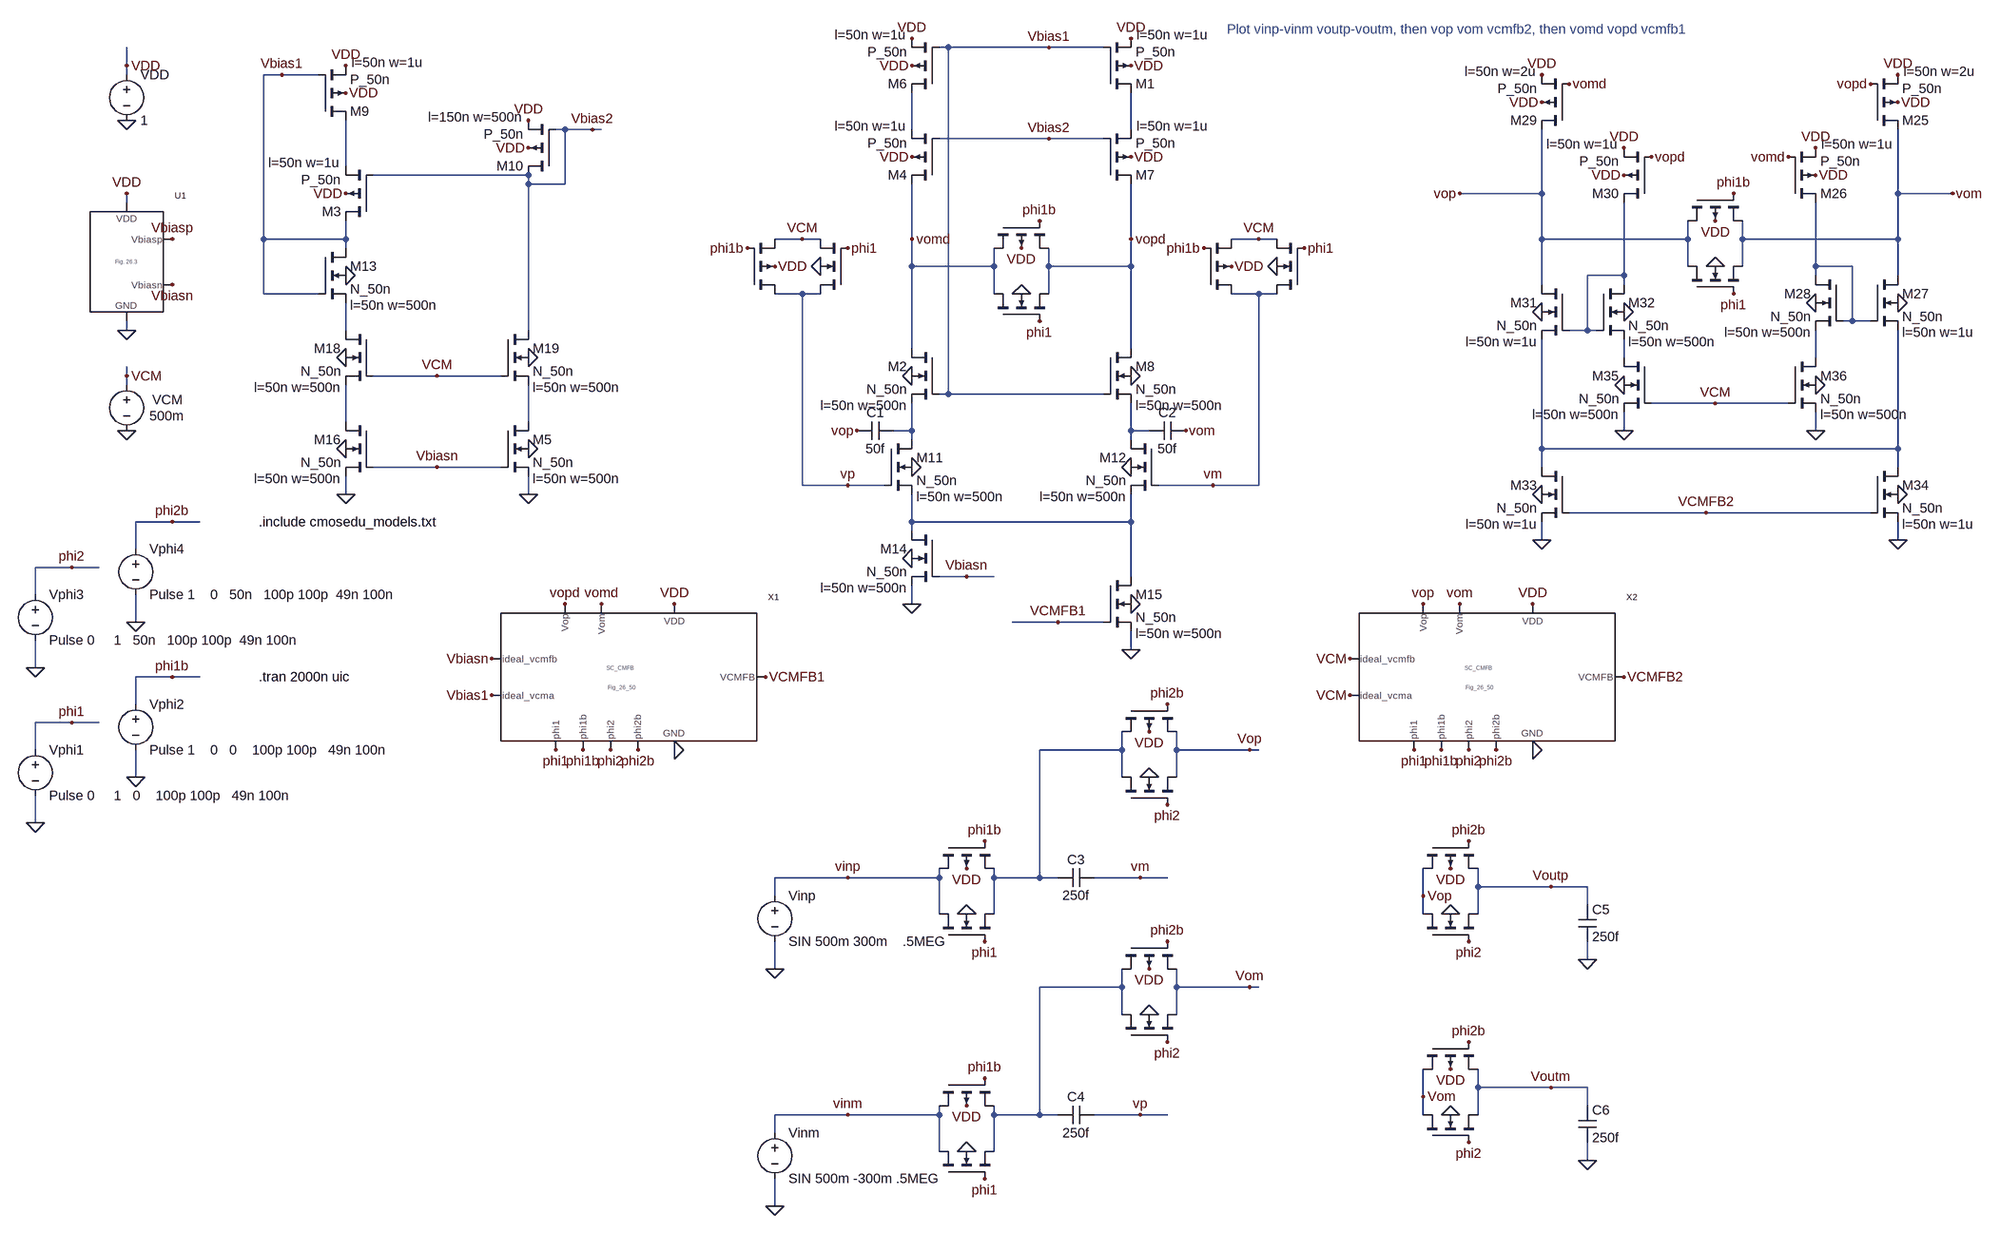
[diagram p0: schematic Fig26_59.asc]
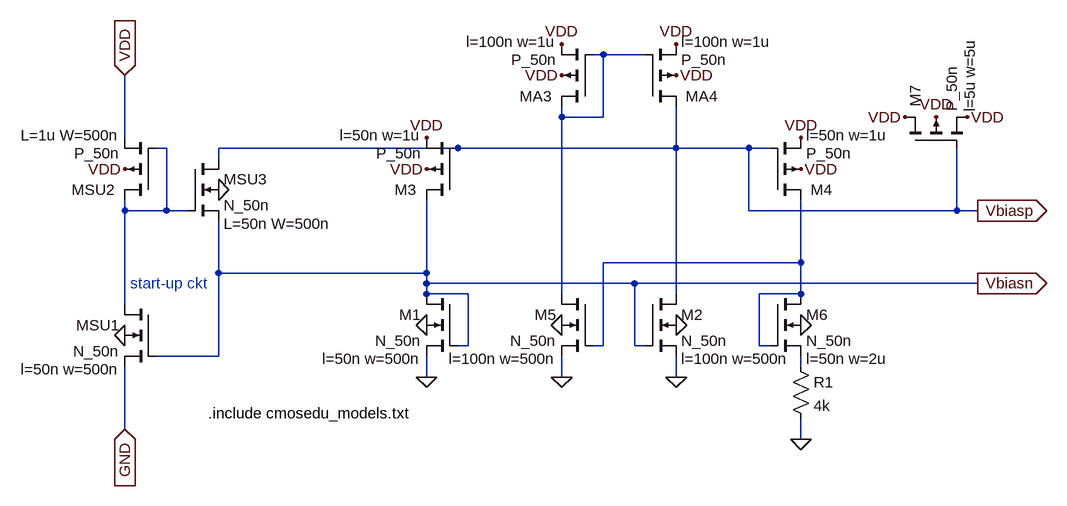
[diagram p1: sub-circuit fig_26_3.asc]
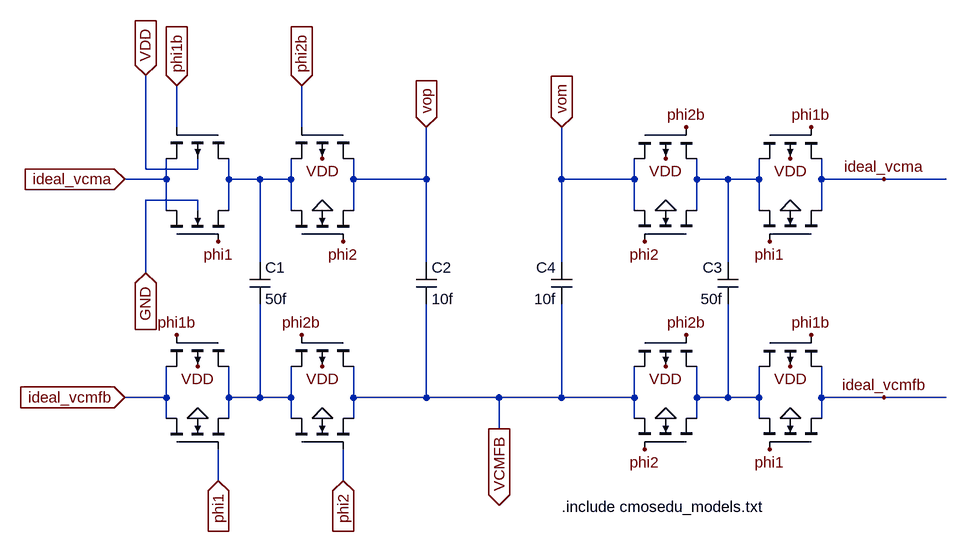
[diagram p2: sub-circuit fig_26_50.asc]
Fig26_59.asc, the LTspice schematic file:
Version 4
SHEET 1 4072 1492
WIRE 2240 -592 2224 -592
WIRE 2416 -592 2240 -592
WIRE 2512 -592 2416 -592
WIRE 800 -560 800 -592
WIRE 800 -544 800 -560
WIRE 1072 -544 1040 -544
WIRE 1136 -544 1072 -544
WIRE 1568 -448 1552 -448
WIRE 1616 -448 1568 -448
WIRE 1632 -448 1616 -448
WIRE 2176 -448 2176 -512
WIRE 2560 -448 2560 -512
WIRE 2416 -432 2224 -432
WIRE 2512 -432 2416 -432
WIRE 1184 -384 1184 -464
WIRE 1504 -368 1232 -368
WIRE 1504 -352 1504 -368
WIRE 1568 -352 1568 -448
WIRE 1568 -352 1504 -352
WIRE 3280 -336 3280 -448
WIRE 3280 -336 3136 -336
WIRE 3904 -336 3904 -448
WIRE 4000 -336 3904 -336
WIRE 800 -320 800 -336
WIRE 1040 -256 1040 -544
WIRE 1184 -256 1184 -288
WIRE 1184 -256 1040 -256
WIRE 1984 -256 1936 -256
WIRE 2016 -256 1984 -256
WIRE 2176 -256 2176 -352
WIRE 2560 -256 2560 -352
WIRE 2784 -256 2736 -256
WIRE 2816 -256 2784 -256
WIRE 3280 -256 3280 -336
WIRE 3536 -256 3536 -288
WIRE 3536 -256 3280 -256
WIRE 3632 -256 3632 -288
WIRE 3904 -256 3904 -336
WIRE 3904 -256 3632 -256
WIRE 1184 -240 1184 -256
WIRE 2176 -208 2176 -256
WIRE 2320 -208 2320 -240
WIRE 2320 -208 2176 -208
WIRE 2416 -208 2416 -240
WIRE 2560 -208 2560 -256
WIRE 2560 -208 2416 -208
WIRE 3536 -208 3536 -256
WIRE 3632 -208 3632 -256
WIRE 3760 -208 3760 -320
WIRE 3824 -208 3760 -208
WIRE 3424 -192 3424 -320
WIRE 3424 -192 3360 -192
WIRE 3760 -192 3760 -208
WIRE 3904 -192 3904 -256
WIRE 3280 -176 3280 -256
WIRE 3424 -176 3424 -192
WIRE 1040 -160 1040 -256
WIRE 1136 -160 1040 -160
WIRE 1984 -160 1936 -160
WIRE 2016 -160 1984 -160
WIRE 2320 -160 2320 -208
WIRE 2416 -160 2416 -208
WIRE 2784 -160 2736 -160
WIRE 2816 -160 2784 -160
WIRE 3824 -112 3824 -208
WIRE 3824 -112 3808 -112
WIRE 3856 -112 3824 -112
WIRE 800 -96 800 -112
WIRE 1184 -96 1184 -144
WIRE 1504 -96 1504 -352
WIRE 3360 -96 3360 -192
WIRE 3360 -96 3328 -96
WIRE 3376 -96 3360 -96
WIRE 2176 -64 2176 -208
WIRE 2560 -64 2560 -208
WIRE 3424 -48 3424 -80
WIRE 3760 -48 3760 -96
WIRE 800 -16 800 -32
WIRE 1344 -16 1232 -16
WIRE 1456 -16 1344 -16
WIRE 800 0 800 -16
WIRE 2240 16 2240 -592
WIRE 2240 16 2224 16
WIRE 2512 16 2240 16
WIRE 3584 32 3472 32
WIRE 3712 32 3584 32
WIRE 1184 64 1184 0
WIRE 1504 64 1504 0
WIRE 2176 80 2176 32
WIRE 2176 80 2144 80
WIRE 2560 80 2560 32
WIRE 2592 80 2560 80
WIRE 3424 80 3424 48
WIRE 3760 80 3760 48
WIRE 2176 96 2176 80
WIRE 2560 96 2560 80
WIRE 3280 112 3280 -80
WIRE 3904 112 3904 -96
WIRE 3904 112 3280 112
WIRE 1344 144 1232 144
WIRE 1456 144 1344 144
WIRE 3280 144 3280 112
WIRE 3904 144 3904 112
WIRE 1984 176 1984 -160
WIRE 2064 176 1984 176
WIRE 2128 176 2064 176
WIRE 2704 176 2608 176
WIRE 2784 176 2784 -160
WIRE 2784 176 2704 176
WIRE 1184 192 1184 160
WIRE 1504 192 1504 160
WIRE 3568 224 3328 224
WIRE 3856 224 3568 224
WIRE 880 240 816 240
WIRE 928 240 880 240
WIRE 2176 240 2176 192
WIRE 2560 240 2560 192
WIRE 2560 240 2176 240
WIRE 2176 256 2176 240
WIRE 3280 272 3280 240
WIRE 3904 272 3904 240
WIRE 816 288 816 240
WIRE 704 320 640 320
WIRE 752 320 704 320
WIRE 2272 336 2224 336
WIRE 2320 336 2272 336
WIRE 2560 336 2560 240
WIRE 640 368 640 320
WIRE 2176 384 2176 352
WIRE 816 416 816 368
WIRE 2432 416 2352 416
WIRE 2512 416 2432 416
WIRE 2560 464 2560 432
WIRE 640 496 640 448
WIRE 880 512 816 512
WIRE 928 512 880 512
WIRE 816 560 816 512
WIRE 704 592 640 592
WIRE 752 592 704 592
WIRE 640 640 640 592
WIRE 2544 640 2544 608
WIRE 2544 640 2400 640
WIRE 2640 640 2640 608
WIRE 2768 640 2640 640
WIRE 2784 640 2768 640
WIRE 816 688 816 640
WIRE 2544 688 2544 640
WIRE 2640 688 2640 640
WIRE 640 768 640 720
WIRE 2064 864 1936 864
WIRE 2224 864 2224 848
WIRE 2224 864 2064 864
WIRE 2320 864 2320 848
WIRE 2400 864 2400 640
WIRE 2400 864 2320 864
WIRE 2432 864 2400 864
WIRE 2576 864 2496 864
WIRE 2624 864 2576 864
WIRE 3168 880 3168 848
WIRE 3296 880 3168 880
WIRE 3360 880 3296 880
WIRE 1936 896 1936 864
WIRE 3072 896 3072 848
WIRE 3360 912 3360 880
WIRE 2224 928 2224 864
WIRE 2320 928 2320 864
WIRE 3072 928 3072 896
WIRE 3168 928 3168 880
WIRE 3360 1008 3360 976
WIRE 1936 1024 1936 976
WIRE 2544 1056 2544 1024
WIRE 2544 1056 2400 1056
WIRE 2640 1056 2640 1024
WIRE 2768 1056 2640 1056
WIRE 2784 1056 2768 1056
WIRE 2544 1104 2544 1056
WIRE 2640 1104 2640 1056
WIRE 3168 1232 3168 1200
WIRE 3296 1232 3168 1232
WIRE 3360 1232 3296 1232
WIRE 3072 1248 3072 1200
WIRE 3360 1264 3360 1232
WIRE 2064 1280 1936 1280
WIRE 2224 1280 2224 1264
WIRE 2224 1280 2064 1280
WIRE 2320 1280 2320 1264
WIRE 2400 1280 2400 1056
WIRE 2400 1280 2320 1280
WIRE 2432 1280 2400 1280
WIRE 2576 1280 2496 1280
WIRE 2624 1280 2576 1280
WIRE 3072 1280 3072 1248
WIRE 3168 1280 3168 1232
WIRE 1936 1312 1936 1280
WIRE 2224 1344 2224 1280
WIRE 2320 1344 2320 1280
WIRE 3360 1360 3360 1328
WIRE 1936 1440 1936 1392
FLAG 800 -464 0
FLAG 800 -560 VDD
FLAG 2176 -16 0
FLAG 1184 -336 VDD
FLAG 800 -336 VDD
FLAG 800 -96 0
FLAG 800 80 0
FLAG 880 -176 Vbiasn
FLAG 880 -256 Vbiasp
FLAG 800 -16 VCM
FLAG 2176 -560 VDD
FLAG 1184 -512 VDD
FLAG 1184 -560 VDD
FLAG 1504 -416 VDD
FLAG 1504 -464 VDD
FLAG 1184 -192 0
FLAG 1504 112 0
FLAG 1184 112 0
FLAG 1184 -48 0
FLAG 1504 -48 0
FLAG 1184 192 0
FLAG 1504 192 0
FLAG 1344 -16 VCM
FLAG 1344 144 Vbiasn
FLAG 1616 -448 Vbias2
FLAG 2560 -560 VDD
FLAG 2176 -608 VDD
FLAG 2560 -608 VDD
FLAG 2176 -400 VDD
FLAG 2560 -400 VDD
FLAG 2560 -16 0
FLAG 2176 144 0
FLAG 2560 144 0
FLAG 2176 304 0
FLAG 2560 384 0
FLAG 2176 384 0
FLAG 2560 464 0
FLAG 2272 336 Vbiasn
FLAG 2432 416 VCMFB1
FLAG 2416 -592 Vbias1
FLAG 2416 -432 Vbias2
FLAG 2368 -240 VDD
FLAG 2400 -288 phi1b
FLAG 2368 -160 0
FLAG 2400 -112 phi1
FLAG 1760 640 0
FLAG 1760 384 VDD
FLAG 1920 512 VCMFB1
FLAG 1552 640 phi1
FLAG 1600 640 phi1b
FLAG 1648 640 phi2
FLAG 1696 640 phi2b
FLAG 1440 480 Vbiasn
FLAG 1440 544 Vbias1
FLAG 1568 384 vopd
FLAG 1632 384 vomd
FLAG 2176 -256 vomd
FLAG 2560 -256 vopd
FLAG 2064 176 vp
FLAG 2704 176 vm
FLAG 1936 -208 VDD
FLAG 1888 -240 phi1b
FLAG 2016 -208 0
FLAG 2064 -240 phi1
FLAG 1984 -256 VCM
FLAG 2736 -208 VDD
FLAG 2688 -240 phi1b
FLAG 2816 -208 0
FLAG 2864 -240 phi1
FLAG 2784 -256 VCM
FLAG 1072 -544 Vbias1
FLAG 2080 80 vop
FLAG 2656 80 vom
FLAG 3904 -544 VDD
FLAG 3904 -496 VDD
FLAG 3760 -416 VDD
FLAG 3760 -368 VDD
FLAG 3904 -144 0
FLAG 3760 -144 0
FLAG 3856 -528 vopd
FLAG 3712 -400 vomd
FLAG 3280 -544 VDD
FLAG 3280 -496 VDD
FLAG 3424 -416 VDD
FLAG 3424 -368 VDD
FLAG 3280 -128 0
FLAG 3424 -128 0
FLAG 3328 -528 vomd
FLAG 3472 -400 vopd
FLAG 3280 192 0
FLAG 3904 192 0
FLAG 3568 224 VCMFB2
FLAG 3136 -336 vop
FLAG 4000 -336 vom
FLAG 3424 0 0
FLAG 3424 80 0
FLAG 3760 0 0
FLAG 3760 80 0
FLAG 3904 272 0
FLAG 3280 272 0
FLAG 3584 32 VCM
FLAG 3584 -288 VDD
FLAG 3616 -336 phi1b
FLAG 3584 -208 0
FLAG 3616 -160 phi1
FLAG 3264 640 0
FLAG 3264 384 VDD
FLAG 3424 512 VCMFB2
FLAG 3056 640 phi1
FLAG 3104 640 phi1b
FLAG 3152 640 phi2
FLAG 3200 640 phi2b
FLAG 2944 480 VCM
FLAG 2944 544 VCM
FLAG 3072 384 vop
FLAG 3136 384 vom
FLAG 2272 848 VDD
FLAG 2304 800 phi1b
FLAG 2272 928 0
FLAG 2304 976 phi1
FLAG 1936 1024 0
FLAG 2576 864 vm
FLAG 2592 608 VDD
FLAG 2624 560 phi2b
FLAG 2592 688 0
FLAG 2624 736 phi2
FLAG 2768 640 Vop
FLAG 2272 1264 VDD
FLAG 2304 1216 phi1b
FLAG 2272 1344 0
FLAG 2304 1392 phi1
FLAG 1936 1440 0
FLAG 2576 1280 vp
FLAG 2592 1024 VDD
FLAG 2624 976 phi2b
FLAG 2592 1104 0
FLAG 2624 1152 phi2
FLAG 2768 1056 Vom
FLAG 3120 848 VDD
FLAG 3152 800 phi2b
FLAG 3120 928 0
FLAG 3152 976 phi2
FLAG 3296 880 Voutp
FLAG 3120 1200 VDD
FLAG 3152 1152 phi2b
FLAG 3120 1280 0
FLAG 3152 1328 phi2
FLAG 3296 1232 Voutm
FLAG 3072 896 Vop
FLAG 3072 1248 Vom
FLAG 3360 1008 0
FLAG 3360 1360 0
FLAG 2064 864 vinp
FLAG 2064 1280 vinm
FLAG 640 768 0
FLAG 704 592 phi1
FLAG 816 688 0
FLAG 880 512 phi1b
FLAG 640 496 0
FLAG 704 320 phi2
FLAG 816 416 0
FLAG 880 240 phi2b
SYMBOL voltage 800 -560 R0
WINDOW 123 0 0 Left 2
WINDOW 39 0 0 Left 2
SYMATTR InstName VDD
SYMATTR Value 1
SYMBOL nmos4 2224 -64 M0
WINDOW 123 56 100 Left 2
SYMATTR Value2 l=50n w=500n
SYMATTR InstName M2
SYMATTR Value N_50n
SYMBOL pmos4 1232 -288 R180
WINDOW 123 58 102 Left 2
WINDOW 0 56 16 Left 2
SYMATTR Value2 l=50n w=1u
SYMATTR InstName M3
SYMATTR Value P_50n
SYMBOL voltage 800 -16 R0
WINDOW 0 45 42 Left 2
WINDOW 3 40 70 Left 2
WINDOW 123 0 0 Left 2
WINDOW 39 0 0 Left 2
SYMATTR InstName VCM
SYMATTR Value 500m
SYMBOL Fig_26_3 736 -208 R0
SYMATTR InstName U1
SYMBOL pmos4 2224 -512 R180
WINDOW 123 58 102 Left 2
WINDOW 0 56 16 Left 2
SYMATTR Value2 l=50n w=1u
SYMATTR InstName M6
SYMATTR Value P_50n
SYMBOL pmos4 1136 -464 M180
WINDOW 123 58 102 Left 2
WINDOW 0 56 16 Left 2
SYMATTR Value2 l=50n w=1u
SYMATTR InstName M9
SYMATTR Value P_50n
SYMBOL pmos4 1552 -368 R180
WINDOW 123 58 102 Left 2
WINDOW 0 56 16 Left 2
SYMATTR Value2 l=150n w=500n
SYMATTR InstName M10
SYMATTR Value P_50n
SYMBOL nmos4 1136 -240 R0
WINDOW 123 56 100 Left 2
SYMATTR Value2 l=50n w=500n
SYMATTR InstName M13
SYMATTR Value N_50n
SYMBOL nmos4 1456 64 R0
WINDOW 123 56 100 Left 2
SYMATTR Value2 l=50n w=500n
SYMATTR InstName M5
SYMATTR Value N_50n
SYMBOL nmos4 1232 64 M0
WINDOW 123 56 100 Left 2
SYMATTR Value2 l=50n w=500n
SYMATTR InstName M16
SYMATTR Value N_50n
SYMBOL nmos4 1232 -96 M0
WINDOW 123 56 100 Left 2
SYMATTR Value2 l=50n w=500n
SYMATTR InstName M18
SYMATTR Value N_50n
SYMBOL nmos4 1456 -96 R0
WINDOW 123 56 100 Left 2
SYMATTR Value2 l=50n w=500n
SYMATTR InstName M19
SYMATTR Value N_50n
SYMBOL pmos4 2512 -512 M180
WINDOW 123 58 102 Left 2
WINDOW 0 56 16 Left 2
SYMATTR Value2 l=50n w=1u
SYMATTR InstName M1
SYMATTR Value P_50n
SYMBOL pmos4 2224 -352 R180
WINDOW 123 58 102 Left 2
WINDOW 0 56 16 Left 2
SYMATTR Value2 l=50n w=1u
SYMATTR InstName M4
SYMATTR Value P_50n
SYMBOL pmos4 2512 -352 M180
WINDOW 123 58 102 Left 2
WINDOW 0 56 16 Left 2
SYMATTR Value2 l=50n w=1u
SYMATTR InstName M7
SYMATTR Value P_50n
SYMBOL nmos4 2512 -64 R0
WINDOW 123 56 100 Left 2
SYMATTR Value2 l=50n w=500n
SYMATTR InstName M8
SYMATTR Value N_50n
SYMBOL nmos4 2128 96 R0
WINDOW 123 56 100 Left 2
SYMATTR Value2 l=50n w=500n
SYMATTR InstName M11
SYMATTR Value N_50n
SYMBOL nmos4 2608 96 M0
WINDOW 123 56 100 Left 2
SYMATTR Value2 l=50n w=500n
SYMATTR InstName M12
SYMATTR Value N_50n
SYMBOL nmos4 2224 256 M0
WINDOW 123 56 100 Left 2
SYMATTR Value2 l=50n w=500n
SYMATTR InstName M14
SYMATTR Value N_50n
SYMBOL nmos4 2512 336 R0
WINDOW 123 56 100 Left 2
SYMATTR Value2 l=50n w=500n
SYMATTR InstName M15
SYMATTR Value N_50n
SYMBOL pmos4 2320 -288 M90
WINDOW 0 56 16 Invisible 2
WINDOW 3 56 72 Invisible 2
SYMATTR InstName M17
SYMATTR Value P_50n
SYMATTR Value2 l=50n w=500n
SYMBOL nmos4 2320 -112 R270
WINDOW 0 56 32 Invisible 2
WINDOW 3 56 72 Invisible 2
SYMATTR InstName M20
SYMATTR Value N_50n
SYMATTR Value2 l=50n w=500n
SYMBOL Fig_26_50 1488 592 R0
SYMATTR InstName X1
SYMBOL pmos4 1888 -160 M180
WINDOW 0 56 16 Invisible 2
WINDOW 3 56 72 Invisible 2
SYMATTR InstName M21
SYMATTR Value P_50n
SYMATTR Value2 l=50n w=500n
SYMBOL nmos4 2064 -160 R180
WINDOW 0 56 32 Invisible 2
WINDOW 3 56 72 Invisible 2
SYMATTR InstName M22
SYMATTR Value N_50n
SYMATTR Value2 l=50n w=500n
SYMBOL pmos4 2688 -160 M180
WINDOW 0 56 16 Invisible 2
WINDOW 3 56 72 Invisible 2
SYMATTR InstName M23
SYMATTR Value P_50n
SYMATTR Value2 l=50n w=500n
SYMBOL nmos4 2864 -160 R180
WINDOW 0 56 32 Invisible 2
WINDOW 3 56 72 Invisible 2
SYMATTR InstName M24
SYMATTR Value N_50n
SYMATTR Value2 l=50n w=500n
SYMBOL cap 2144 64 R90
WINDOW 0 0 32 VBottom 2
WINDOW 3 32 32 VTop 2
SYMATTR InstName C1
SYMATTR Value 50f
SYMBOL cap 2656 64 R90
WINDOW 0 0 32 VBottom 2
WINDOW 3 32 32 VTop 2
SYMATTR InstName C2
SYMATTR Value 50f
SYMBOL pmos4 3856 -448 M180
WINDOW 123 58 102 Left 2
WINDOW 0 56 16 Left 2
SYMATTR Value2 l=50n w=2u
SYMATTR InstName M25
SYMATTR Value P_50n
SYMBOL pmos4 3712 -320 M180
WINDOW 123 58 102 Left 2
WINDOW 0 56 16 Left 2
SYMATTR Value2 l=50n w=1u
SYMATTR InstName M26
SYMATTR Value P_50n
SYMBOL nmos4 3856 -192 R0
WINDOW 123 56 100 Left 2
SYMATTR Value2 l=50n w=1u
SYMATTR InstName M27
SYMATTR Value N_50n
SYMBOL nmos4 3808 -192 M0
WINDOW 123 56 100 Left 2
SYMATTR Value2 l=50n w=500n
SYMATTR InstName M28
SYMATTR Value N_50n
SYMBOL pmos4 3328 -448 R180
WINDOW 123 58 102 Left 2
WINDOW 0 56 16 Left 2
SYMATTR Value2 l=50n w=2u
SYMATTR InstName M29
SYMATTR Value P_50n
SYMBOL pmos4 3472 -320 R180
WINDOW 123 58 102 Left 2
WINDOW 0 56 16 Left 2
SYMATTR Value2 l=50n w=1u
SYMATTR InstName M30
SYMATTR Value P_50n
SYMBOL nmos4 3328 -176 M0
WINDOW 123 56 100 Left 2
SYMATTR Value2 l=50n w=1u
SYMATTR InstName M31
SYMATTR Value N_50n
SYMBOL nmos4 3376 -176 R0
WINDOW 123 56 100 Left 2
SYMATTR Value2 l=50n w=500n
SYMATTR InstName M32
SYMATTR Value N_50n
SYMBOL nmos4 3328 144 M0
WINDOW 123 56 100 Left 2
SYMATTR Value2 l=50n w=1u
SYMATTR InstName M33
SYMATTR Value N_50n
SYMBOL nmos4 3856 144 R0
WINDOW 123 56 100 Left 2
SYMATTR Value2 l=50n w=1u
SYMATTR InstName M34
SYMATTR Value N_50n
SYMBOL nmos4 3472 -48 M0
WINDOW 123 56 100 Left 2
SYMATTR Value2 l=50n w=500n
SYMATTR InstName M35
SYMATTR Value N_50n
SYMBOL nmos4 3712 -48 R0
WINDOW 123 56 100 Left 2
SYMATTR Value2 l=50n w=500n
SYMATTR InstName M36
SYMATTR Value N_50n
SYMBOL pmos4 3536 -336 M90
WINDOW 0 56 16 Invisible 2
WINDOW 3 56 72 Invisible 2
SYMATTR InstName M37
SYMATTR Value P_50n
SYMATTR Value2 l=50n w=500n
SYMBOL nmos4 3536 -160 R270
WINDOW 0 56 32 Invisible 2
WINDOW 3 56 72 Invisible 2
SYMATTR InstName M38
SYMATTR Value N_50n
SYMATTR Value2 l=50n w=500n
SYMBOL Fig_26_50 2992 592 R0
SYMATTR InstName X2
SYMBOL pmos4 2224 800 M90
WINDOW 0 56 16 Invisible 2
WINDOW 3 56 72 Invisible 2
SYMATTR InstName M39
SYMATTR Value P_50n
SYMATTR Value2 l=50n w=500n
SYMBOL nmos4 2224 976 R270
WINDOW 0 56 32 Invisible 2
WINDOW 3 56 72 Invisible 2
SYMATTR InstName M40
SYMATTR Value N_50n
SYMATTR Value2 l=50n w=500n
SYMBOL voltage 1936 880 R0
SYMATTR InstName Vinp
SYMATTR Value SIN 500m 300m	.5MEG
SYMBOL cap 2496 848 R90
WINDOW 0 0 32 VBottom 2
WINDOW 3 32 32 VTop 2
SYMATTR InstName C3
SYMATTR Value 250f
SYMBOL pmos4 2544 560 M90
WINDOW 0 56 16 Invisible 2
WINDOW 3 56 72 Invisible 2
SYMATTR InstName M41
SYMATTR Value P_50n
SYMATTR Value2 l=50n w=500n
SYMBOL nmos4 2544 736 R270
WINDOW 0 56 32 Invisible 2
WINDOW 3 56 72 Invisible 2
SYMATTR InstName M42
SYMATTR Value N_50n
SYMATTR Value2 l=50n w=500n
SYMBOL pmos4 2224 1216 M90
WINDOW 0 56 16 Invisible 2
WINDOW 3 56 72 Invisible 2
SYMATTR InstName M43
SYMATTR Value P_50n
SYMATTR Value2 l=50n w=500n
SYMBOL nmos4 2224 1392 R270
WINDOW 0 56 32 Invisible 2
WINDOW 3 56 72 Invisible 2
SYMATTR InstName M44
SYMATTR Value N_50n
SYMATTR Value2 l=50n w=500n
SYMBOL voltage 1936 1296 R0
SYMATTR InstName Vinm
SYMATTR Value SIN 500m -300m .5MEG
SYMBOL cap 2496 1264 R90
WINDOW 0 0 32 VBottom 2
WINDOW 3 32 32 VTop 2
SYMATTR InstName C4
SYMATTR Value 250f
SYMBOL pmos4 2544 976 M90
WINDOW 0 56 16 Invisible 2
WINDOW 3 56 72 Invisible 2
SYMATTR InstName M45
SYMATTR Value P_50n
SYMATTR Value2 l=50n w=500n
SYMBOL nmos4 2544 1152 R270
WINDOW 0 56 32 Invisible 2
WINDOW 3 56 72 Invisible 2
SYMATTR InstName M46
SYMATTR Value N_50n
SYMATTR Value2 l=50n w=500n
SYMBOL pmos4 3072 800 M90
WINDOW 0 56 16 Invisible 2
WINDOW 3 56 72 Invisible 2
SYMATTR InstName M47
SYMATTR Value P_50n
SYMATTR Value2 l=50n w=500n
SYMBOL nmos4 3072 976 R270
WINDOW 0 56 32 Invisible 2
WINDOW 3 56 72 Invisible 2
SYMATTR InstName M48
SYMATTR Value N_50n
SYMATTR Value2 l=50n w=500n
SYMBOL pmos4 3072 1152 M90
WINDOW 0 56 16 Invisible 2
WINDOW 3 56 72 Invisible 2
SYMATTR InstName M49
SYMATTR Value P_50n
SYMATTR Value2 l=50n w=500n
SYMBOL nmos4 3072 1328 R270
WINDOW 0 56 32 Invisible 2
WINDOW 3 56 72 Invisible 2
SYMATTR InstName M50
SYMATTR Value N_50n
SYMATTR Value2 l=50n w=500n
SYMBOL cap 3344 912 R0
SYMATTR InstName C5
SYMATTR Value 250f
SYMBOL cap 3344 1264 R0
SYMATTR InstName C6
SYMATTR Value 250f
SYMBOL voltage 640 624 R0
SYMATTR InstName Vphi1
SYMATTR Value Pulse 0 	1   0    100p 100p   49n 100n
SYMBOL voltage 816 544 R0
SYMATTR InstName Vphi2
SYMATTR Value Pulse 1    0   0    100p 100p   49n 100n
SYMBOL voltage 640 352 R0
SYMATTR InstName Vphi3
SYMATTR Value Pulse 0 	1   50n   100p 100p  49n 100n
SYMBOL voltage 816 272 R0
SYMATTR InstName Vphi4
SYMATTR Value Pulse 1    0   50n   100p 100p  49n 100n
TEXT 1032 240 Left 2 !.include cmosedu_models.txt
TEXT 1032 512 Left 2 !.tran 2000n uic
TEXT 2728 -624 Left 2 ;Plot vinp-vinm voutp-voutm, then vop vom vcmfb2, then vomd vopd vcmfb1

fig_26_3.asc, the sub-circuit schematic file:
Version 4
SHEET 1 2004 680
WIRE 1280 -304 1264 -304
WIRE 1344 -304 1280 -304
WIRE 1216 -208 1216 -224
WIRE 1280 -208 1280 -304
WIRE 1280 -208 1216 -208
WIRE 544 -176 544 -272
WIRE 608 -160 592 -160
WIRE 1056 -160 688 -160
WIRE 1392 -160 1392 -224
WIRE 1392 -160 1056 -160
WIRE 1504 -160 1392 -160
WIRE 1536 -160 1504 -160
WIRE 688 -144 688 -160
WIRE 544 -64 544 -80
WIRE 608 -64 608 -160
WIRE 608 -64 544 -64
WIRE 640 -64 608 -64
WIRE 1504 -64 1504 -160
WIRE 1824 -64 1824 -160
WIRE 1824 -64 1504 -64
WIRE 1856 -64 1824 -64
WIRE 1584 16 1584 -80
WIRE 1584 16 1280 16
WIRE 688 32 688 -48
WIRE 1008 32 1008 -80
WIRE 1008 32 688 32
WIRE 1008 48 1008 32
WIRE 1328 48 1008 48
WIRE 1856 48 1328 48
WIRE 1008 64 1008 48
WIRE 1072 64 1008 64
WIRE 1216 64 1216 -208
WIRE 1392 64 1392 -160
WIRE 1584 64 1584 16
WIRE 1584 64 1520 64
WIRE 544 80 544 -64
WIRE 1072 144 1072 64
WIRE 1072 144 1056 144
WIRE 1280 144 1280 16
WIRE 1280 144 1264 144
WIRE 1328 144 1328 48
WIRE 1344 144 1328 144
WIRE 1520 144 1520 64
WIRE 1536 144 1520 144
WIRE 688 160 688 32
WIRE 688 160 592 160
WIRE 1584 176 1584 160
WIRE 1008 192 1008 160
WIRE 1216 192 1216 160
WIRE 1392 192 1392 160
WIRE 544 272 544 176
WIRE 1584 288 1584 256
FLAG 544 -128 VDD
FLAG 1008 -128 VDD
FLAG 1008 -176 VDD
FLAG 1584 -128 VDD
FLAG 1584 -176 VDD
FLAG 1584 288 0
FLAG 1584 112 0
FLAG 1392 -272 VDD
FLAG 1392 -320 VDD
FLAG 1216 -272 VDD
FLAG 1216 -320 VDD
FLAG 1392 112 0
FLAG 1792 -208 VDD
FLAG 1744 -208 VDD
FLAG 1840 -208 VDD
FLAG 544 -272 VDD
IOPIN 544 -272 In
FLAG 544 272 GND
IOPIN 544 272 In
FLAG 688 -96 0
FLAG 544 128 0
FLAG 1008 192 0
FLAG 1008 112 0
FLAG 1216 112 0
FLAG 1216 192 0
FLAG 1392 192 0
FLAG 1856 -64 Vbiasp
IOPIN 1856 -64 Out
FLAG 1856 48 Vbiasn
IOPIN 1856 48 Out
SYMBOL pmos4 592 -80 R180
WINDOW 0 63 16 Left 2
WINDOW 123 56 100 Left 2
SYMATTR InstName MSU2
SYMATTR Value2 L=1u W=500n
SYMATTR Value P_50n
SYMBOL nmos4 592 80 M0
WINDOW 123 56 100 Left 2
SYMATTR Value2 l=50n w=500n
SYMATTR InstName MSU1
SYMATTR Value N_50n
SYMBOL nmos4 640 -144 R0
WINDOW 123 56 100 Left 2
SYMATTR Value2 L=50n W=500n
SYMATTR InstName MSU3
SYMATTR Value N_50n
SYMBOL pmos4 1056 -80 R180
WINDOW 0 63 16 Left 2
WINDOW 123 56 100 Left 2
SYMATTR InstName M3
SYMATTR Value2 l=50n w=1u
SYMATTR Value P_50n
SYMBOL pmos4 1536 -80 M180
WINDOW 0 63 16 Left 2
WINDOW 123 56 100 Left 2
SYMATTR InstName M4
SYMATTR Value2 l=50n w=1u
SYMATTR Value P_50n
SYMBOL nmos4 1056 64 M0
WINDOW 123 56 100 Left 2
SYMATTR Value2 l=50n w=500n
SYMATTR InstName M1
SYMATTR Value N_50n
SYMBOL res 1568 160 R0
SYMATTR InstName R1
SYMATTR Value 4k
SYMBOL pmos4 1344 -224 M180
WINDOW 0 63 16 Left 2
WINDOW 123 56 100 Left 2
SYMATTR InstName MA4
SYMATTR Value2 l=100n w=1u
SYMATTR Value P_50n
SYMBOL pmos4 1264 -224 R180
WINDOW 0 63 16 Left 2
WINDOW 123 56 100 Left 2
SYMATTR InstName MA3
SYMATTR Value2 l=100n w=1u
SYMATTR Value P_50n
SYMBOL nmos4 1264 64 M0
WINDOW 123 56 100 Left 2
SYMATTR Value2 l=100n w=500n
SYMATTR InstName M5
SYMATTR Value N_50n
SYMBOL pmos4 1744 -160 R270
WINDOW 0 63 16 Left 2
WINDOW 123 56 100 Left 2
SYMATTR InstName M7
SYMATTR Value2 l=5u w=5u
SYMATTR Value P_50n
SYMBOL nmos4 1344 64 R0
WINDOW 123 56 100 Left 2
SYMATTR Value2 l=100n w=500n
SYMATTR InstName M2
SYMATTR Value N_50n
SYMBOL nmos4 1536 64 R0
WINDOW 123 56 100 Left 2
SYMATTR Value2 l=50n w=2u
SYMATTR InstName M6
SYMATTR Value N_50n
TEXT 552 48 Left 2 ;start-up ckt
TEXT 672 248 Left 2 !.include cmosedu_models.txt

fig_26_50.asc, the sub-circuit schematic file:
Version 4
SHEET 1 1620 680
WIRE 432 -304 432 -368
WIRE 624 -304 624 -368
WIRE 384 -240 384 -384
WIRE 464 -240 464 -256
WIRE 464 -240 384 -240
WIRE 416 -224 416 -256
WIRE 416 -224 352 -224
WIRE 512 -224 512 -256
WIRE 560 -224 512 -224
WIRE 608 -224 608 -256
WIRE 608 -224 560 -224
WIRE 704 -224 704 -256
WIRE 816 -224 816 -304
WIRE 816 -224 704 -224
WIRE 1024 -224 1024 -304
WIRE 1136 -224 1136 -256
WIRE 1136 -224 1024 -224
WIRE 1232 -224 1232 -256
WIRE 1280 -224 1232 -224
WIRE 1328 -224 1328 -256
WIRE 1328 -224 1280 -224
WIRE 1424 -224 1424 -256
WIRE 1520 -224 1424 -224
WIRE 1616 -224 1520 -224
WIRE 464 -192 384 -192
WIRE 416 -176 416 -224
WIRE 464 -176 464 -192
WIRE 512 -176 512 -224
WIRE 608 -176 608 -224
WIRE 704 -176 704 -224
WIRE 1136 -176 1136 -224
WIRE 1232 -176 1232 -224
WIRE 1328 -176 1328 -224
WIRE 1424 -176 1424 -224
WIRE 560 -96 560 -224
WIRE 816 -96 816 -224
WIRE 1024 -96 1024 -224
WIRE 1280 -96 1280 -224
WIRE 384 -80 384 -192
WIRE 416 112 416 64
WIRE 416 112 352 112
WIRE 512 112 512 64
WIRE 560 112 560 -32
WIRE 560 112 512 112
WIRE 608 112 608 64
WIRE 608 112 560 112
WIRE 704 112 704 64
WIRE 816 112 816 -32
WIRE 816 112 704 112
WIRE 928 112 816 112
WIRE 1024 112 1024 -32
WIRE 1024 112 928 112
WIRE 1136 112 1136 64
WIRE 1136 112 1024 112
WIRE 1232 112 1232 64
WIRE 1280 112 1280 -32
WIRE 1280 112 1232 112
WIRE 1328 112 1328 64
WIRE 1328 112 1280 112
WIRE 1424 112 1424 64
WIRE 1520 112 1424 112
WIRE 1616 112 1520 112
WIRE 416 144 416 112
WIRE 512 144 512 112
WIRE 608 144 608 112
WIRE 704 144 704 112
WIRE 1136 144 1136 112
WIRE 1232 144 1232 112
WIRE 1328 144 1328 112
WIRE 1424 144 1424 112
WIRE 928 160 928 112
WIRE 496 240 496 192
WIRE 688 240 688 192
FLAG 496 -128 phi1
FLAG 656 -256 VDD
FLAG 656 -176 0
FLAG 688 -128 phi2
FLAG 464 64 VDD
FLAG 464 144 0
FLAG 432 16 phi1b
FLAG 656 64 VDD
FLAG 656 144 0
FLAG 624 16 phi2b
FLAG 1376 -256 VDD
FLAG 1376 -176 0
FLAG 1344 -128 phi1
FLAG 1408 -304 phi1b
FLAG 1184 -256 VDD
FLAG 1184 -176 0
FLAG 1152 -128 phi2
FLAG 1216 -304 phi2b
FLAG 1376 64 VDD
FLAG 1376 144 0
FLAG 1344 192 phi1
FLAG 1408 16 phi1b
FLAG 1184 64 VDD
FLAG 1184 144 0
FLAG 1152 192 phi2
FLAG 1216 16 phi2b
FLAG 1520 -224 ideal_vcma
FLAG 1520 112 ideal_vcmfb
FLAG 352 -224 ideal_vcma
IOPIN 352 -224 In
FLAG 352 112 ideal_vcmfb
IOPIN 352 112 In
FLAG 384 -384 VDD
IOPIN 384 -384 In
FLAG 384 -80 GND
IOPIN 384 -80 In
FLAG 928 160 VCMFB
IOPIN 928 160 Out
FLAG 816 -304 vop
IOPIN 816 -304 In
FLAG 1024 -304 vom
IOPIN 1024 -304 In
FLAG 432 -368 phi1b
IOPIN 432 -368 In
FLAG 496 240 phi1
IOPIN 496 240 In
FLAG 624 -368 phi2b
IOPIN 624 -368 In
FLAG 688 240 phi2
IOPIN 688 240 In
SYMBOL nmos4 416 -128 R270
WINDOW 0 119 20 Invisible 0
WINDOW 3 157 46 Invisible 0
SYMATTR InstName M1
SYMATTR Value N_50n
SYMATTR Value2 l=50n w=500n
SYMBOL pmos4 512 -304 R90
WINDOW 0 116 21 Invisible 0
WINDOW 3 175 48 Invisible 0
SYMATTR InstName M2
SYMATTR Value P_50n
SYMATTR Value2 l=50n w=500n
SYMBOL nmos4 608 -128 R270
WINDOW 0 119 20 Invisible 0
WINDOW 3 157 46 Invisible 0
SYMATTR InstName M3
SYMATTR Value N_50n
SYMATTR Value2 l=50n w=500n
SYMBOL pmos4 704 -304 R90
WINDOW 0 116 21 Invisible 0
WINDOW 3 175 48 Invisible 0
SYMATTR InstName M4
SYMATTR Value P_50n
SYMATTR Value2 l=50n w=500n
SYMBOL nmos4 416 192 R270
WINDOW 0 119 20 Invisible 0
WINDOW 3 157 46 Invisible 0
SYMATTR InstName M5
SYMATTR Value N_50n
SYMATTR Value2 l=50n w=500n
SYMBOL pmos4 512 16 R90
WINDOW 0 116 21 Invisible 0
WINDOW 3 175 48 Invisible 0
SYMATTR InstName M6
SYMATTR Value P_50n
SYMATTR Value2 l=50n w=500n
SYMBOL nmos4 608 192 R270
WINDOW 0 119 20 Invisible 0
WINDOW 3 157 46 Invisible 0
SYMATTR InstName M7
SYMATTR Value N_50n
SYMATTR Value2 l=50n w=500n
SYMBOL pmos4 704 16 R90
WINDOW 0 116 21 Invisible 0
WINDOW 3 175 48 Invisible 0
SYMATTR InstName M8
SYMATTR Value P_50n
SYMATTR Value2 l=50n w=500n
SYMBOL cap 544 -96 R0
SYMATTR InstName C1
SYMATTR Value 50f
SYMBOL cap 800 -96 R0
SYMATTR InstName C2
SYMATTR Value 10f
SYMBOL nmos4 1424 -128 M270
WINDOW 0 119 20 Invisible 0
WINDOW 3 157 46 Invisible 0
SYMATTR InstName M9
SYMATTR Value N_50n
SYMATTR Value2 l=50n w=500n
SYMBOL pmos4 1328 -304 M90
WINDOW 0 116 21 Invisible 0
WINDOW 3 175 48 Invisible 0
SYMATTR InstName M10
SYMATTR Value P_50n
SYMATTR Value2 l=50n w=500n
SYMBOL nmos4 1232 -128 M270
WINDOW 0 119 20 Invisible 0
WINDOW 3 157 46 Invisible 0
SYMATTR InstName M11
SYMATTR Value N_50n
SYMATTR Value2 l=50n w=500n
SYMBOL pmos4 1136 -304 M90
WINDOW 0 116 21 Invisible 0
WINDOW 3 175 48 Invisible 0
SYMATTR InstName M12
SYMATTR Value P_50n
SYMATTR Value2 l=50n w=500n
SYMBOL nmos4 1424 192 M270
WINDOW 0 119 20 Invisible 0
WINDOW 3 157 46 Invisible 0
SYMATTR InstName M13
SYMATTR Value N_50n
SYMATTR Value2 l=50n w=500n
SYMBOL pmos4 1328 16 M90
WINDOW 0 116 21 Invisible 0
WINDOW 3 175 48 Invisible 0
SYMATTR InstName M14
SYMATTR Value P_50n
SYMATTR Value2 l=50n w=500n
SYMBOL nmos4 1232 192 M270
WINDOW 0 119 20 Invisible 0
WINDOW 3 157 46 Invisible 0
SYMATTR InstName M15
SYMATTR Value N_50n
SYMATTR Value2 l=50n w=500n
SYMBOL pmos4 1136 16 M90
WINDOW 0 116 21 Invisible 0
WINDOW 3 175 48 Invisible 0
SYMATTR InstName M16
SYMATTR Value P_50n
SYMATTR Value2 l=50n w=500n
SYMBOL cap 1296 -96 M0
SYMATTR InstName C3
SYMATTR Value 50f
SYMBOL cap 1040 -96 M0
SYMATTR InstName C4
SYMATTR Value 10f
TEXT 1024 280 Left 0 !.include cmosedu_models.txt

The netlist it stands for:
* Fig26_59.asc
VDD VDD 0 1
M2 vomd Vbias1 N011 0 N_50n l=50n w=500n
M3 Vbias1 Vbias2 N003 VDD P_50n l=50n w=1u
VCM VCM 0 500m
XU1 Vbiasn Vbiasp VDD 0 fig_26_3
M6 N001 Vbias1 VDD VDD P_50n l=50n w=1u
M9 N003 Vbias1 VDD VDD P_50n l=50n w=1u
M10 Vbias2 Vbias2 VDD VDD P_50n l=150n w=500n
M13 Vbias1 Vbias1 N006 0 N_50n l=50n w=500n
M5 N010 Vbiasn 0 0 N_50n l=50n w=500n
M16 N009 Vbiasn 0 0 N_50n l=50n w=500n
M18 N006 VCM N009 0 N_50n l=50n w=500n
M19 Vbias2 VCM N010 0 N_50n l=50n w=500n
M1 N002 Vbias1 VDD VDD P_50n l=50n w=1u
M4 vomd Vbias2 N001 VDD P_50n l=50n w=1u
M7 vopd Vbias2 N002 VDD P_50n l=50n w=1u
M8 vopd Vbias1 N012 0 N_50n l=50n w=500n
M11 N011 vp N014 0 N_50n l=50n w=500n
M12 N012 vm N014 0 N_50n l=50n w=500n
M14 N014 Vbiasn 0 0 N_50n l=50n w=500n
M15 N014 VCMFB1 0 0 N_50n l=50n w=500n
M17 vomd phi1b vopd VDD P_50n l=50n w=500n
M20 vomd phi1 vopd 0 N_50n l=50n w=500n
XX1 Vbiasn Vbias1 vopd vomd phi1 phi1b phi2 phi2b VCMFB1 VDD 0 fig_26_50
M21 vp phi1b VCM VDD P_50n l=50n w=500n
M22 vp phi1 VCM 0 N_50n l=50n w=500n
M23 vm phi1b VCM VDD P_50n l=50n w=500n
M24 vm phi1 VCM 0 N_50n l=50n w=500n
C1 N011 vop 50f
C2 vom N012 50f
M25 vom vopd VDD VDD P_50n l=50n w=2u
M26 N004 vomd VDD VDD P_50n l=50n w=1u
M27 vom N004 N013 0 N_50n l=50n w=1u
M28 N004 N004 N008 0 N_50n l=50n w=500n
M29 vop vomd VDD VDD P_50n l=50n w=2u
M30 N005 vopd VDD VDD P_50n l=50n w=1u
M31 vop N005 N013 0 N_50n l=50n w=1u
M32 N005 N005 N007 0 N_50n l=50n w=500n
M33 N013 VCMFB2 0 0 N_50n l=50n w=1u
M34 N013 VCMFB2 0 0 N_50n l=50n w=1u
M35 N007 VCM 0 0 N_50n l=50n w=500n
M36 N008 VCM 0 0 N_50n l=50n w=500n
M37 vop phi1b vom VDD P_50n l=50n w=500n
M38 vop phi1 vom 0 N_50n l=50n w=500n
XX2 VCM VCM vop vom phi1 phi1b phi2 phi2b VCMFB2 VDD 0 fig_26_50
M39 vinp phi1b N015 VDD P_50n l=50n w=500n
M40 vinp phi1 N015 0 N_50n l=50n w=500n
Vinp vinp 0 SIN 500m 300m	.5MEG
C3 vm N015 250f
M41 N015 phi2b vop VDD P_50n l=50n w=500n
M42 N015 phi2 vop 0 N_50n l=50n w=500n
M43 vinm phi1b N016 VDD P_50n l=50n w=500n
M44 vinm phi1 N016 0 N_50n l=50n w=500n
Vinm vinm 0 SIN 500m -300m .5MEG
C4 vp N016 250f
M45 N016 phi2b vom VDD P_50n l=50n w=500n
M46 N016 phi2 vom 0 N_50n l=50n w=500n
M47 vop phi2b Voutp VDD P_50n l=50n w=500n
M48 vop phi2 Voutp 0 N_50n l=50n w=500n
M49 vom phi2b Voutm VDD P_50n l=50n w=500n
M50 vom phi2 Voutm 0 N_50n l=50n w=500n
C5 Voutp 0 250f
C6 Voutm 0 250f
Vphi1 phi1 0 Pulse 0 	1   0    100p 100p   49n 100n
Vphi2 phi1b 0 Pulse 1    0   0    100p 100p   49n 100n
Vphi3 phi2 0 Pulse 0 	1   50n   100p 100p  49n 100n
Vphi4 phi2b 0 Pulse 1    0   50n   100p 100p  49n 100n

* block symbol definitions
.subckt fig_26_3 Vbiasn Vbiasp VDD GND
MSU2 N002 N002 VDD VDD P_50n L=1u W=500n
MSU1 N002 Vbiasn GND 0 N_50n l=50n w=500n
MSU3 Vbiasp N002 Vbiasn 0 N_50n L=50n W=500n
M3 Vbiasn Vbiasp VDD VDD P_50n l=50n w=1u
M4 N003 Vbiasp VDD VDD P_50n l=50n w=1u
M1 Vbiasn Vbiasn 0 0 N_50n l=50n w=500n
R1 N004 0 4k
MA4 Vbiasp N001 VDD VDD P_50n l=100n w=1u
MA3 N001 N001 VDD VDD P_50n l=100n w=1u
M5 N001 N003 0 0 N_50n l=100n w=500n
M7 VDD Vbiasp VDD VDD P_50n l=5u w=5u
M2 Vbiasp Vbiasn 0 0 N_50n l=100n w=500n
M6 N003 N003 N004 0 N_50n l=50n w=2u
* start-up ckt
.include cmosedu_models.txt
.ends fig_26_3

.subckt fig_26_50 ideal_vcmfb ideal_vcma Vop Vom phi1 phi1b phi2 phi2b VCMFB VDD GND
M1 ideal_vcma phi1 N001 GND N_50n l=50n w=500n
M2 N001 phi1b ideal_vcma VDD P_50n l=50n w=500n
M3 N001 phi2 vop 0 N_50n l=50n w=500n
M4 vop phi2b N001 VDD P_50n l=50n w=500n
M5 ideal_vcmfb phi1 N003 0 N_50n l=50n w=500n
M6 N003 phi1b ideal_vcmfb VDD P_50n l=50n w=500n
M7 N003 phi2 VCMFB 0 N_50n l=50n w=500n
M8 VCMFB phi2b N003 VDD P_50n l=50n w=500n
C1 N001 N003 50f
C2 vop VCMFB 10f
M9 ideal_vcma phi1 N002 0 N_50n l=50n w=500n
M10 N002 phi1b ideal_vcma VDD P_50n l=50n w=500n
M11 N002 phi2 vom 0 N_50n l=50n w=500n
M12 vom phi2b N002 VDD P_50n l=50n w=500n
M13 ideal_vcmfb phi1 N004 0 N_50n l=50n w=500n
M14 N004 phi1b ideal_vcmfb VDD P_50n l=50n w=500n
M15 N004 phi2 VCMFB 0 N_50n l=50n w=500n
M16 VCMFB phi2b N004 VDD P_50n l=50n w=500n
C3 N002 N004 50f
C4 vom VCMFB 10f
.include cmosedu_models.txt
.ends fig_26_50

.model NMOS NMOS
.model PMOS PMOS
.lib standard.mos
.include cmosedu_models.txt
.tran 2000n uic
* Plot vinp-vinm voutp-voutm, then vop vom vcmfb2, then vomd vopd vcmfb1
.backanno
.end